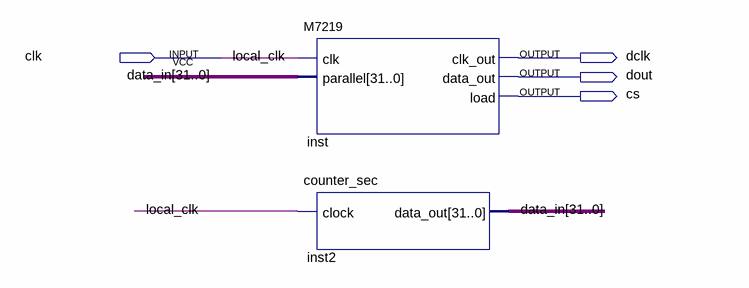
[diagram p0: schematic sheet]
// Quartus schematic max7219.bdf as structural Verilog: 2 symbols, 4 pins
module max7219 (
  input  clk,
  output dclk,
  output dout,
  output cs
);

  wire [31:0] data_in;

  M7219 inst (.clk(clk), .parallel(data_in), .clk_out(dclk), .data_out(dout), .load(cs));
  counter_sec inst2 (.clock(clk), .data_out(data_in));

  // Other names for the same wires on the sheet: local_clk = clk
endmodule
